# EAGLE schematic GPSDOXCO (EAGLE 7.7.0)
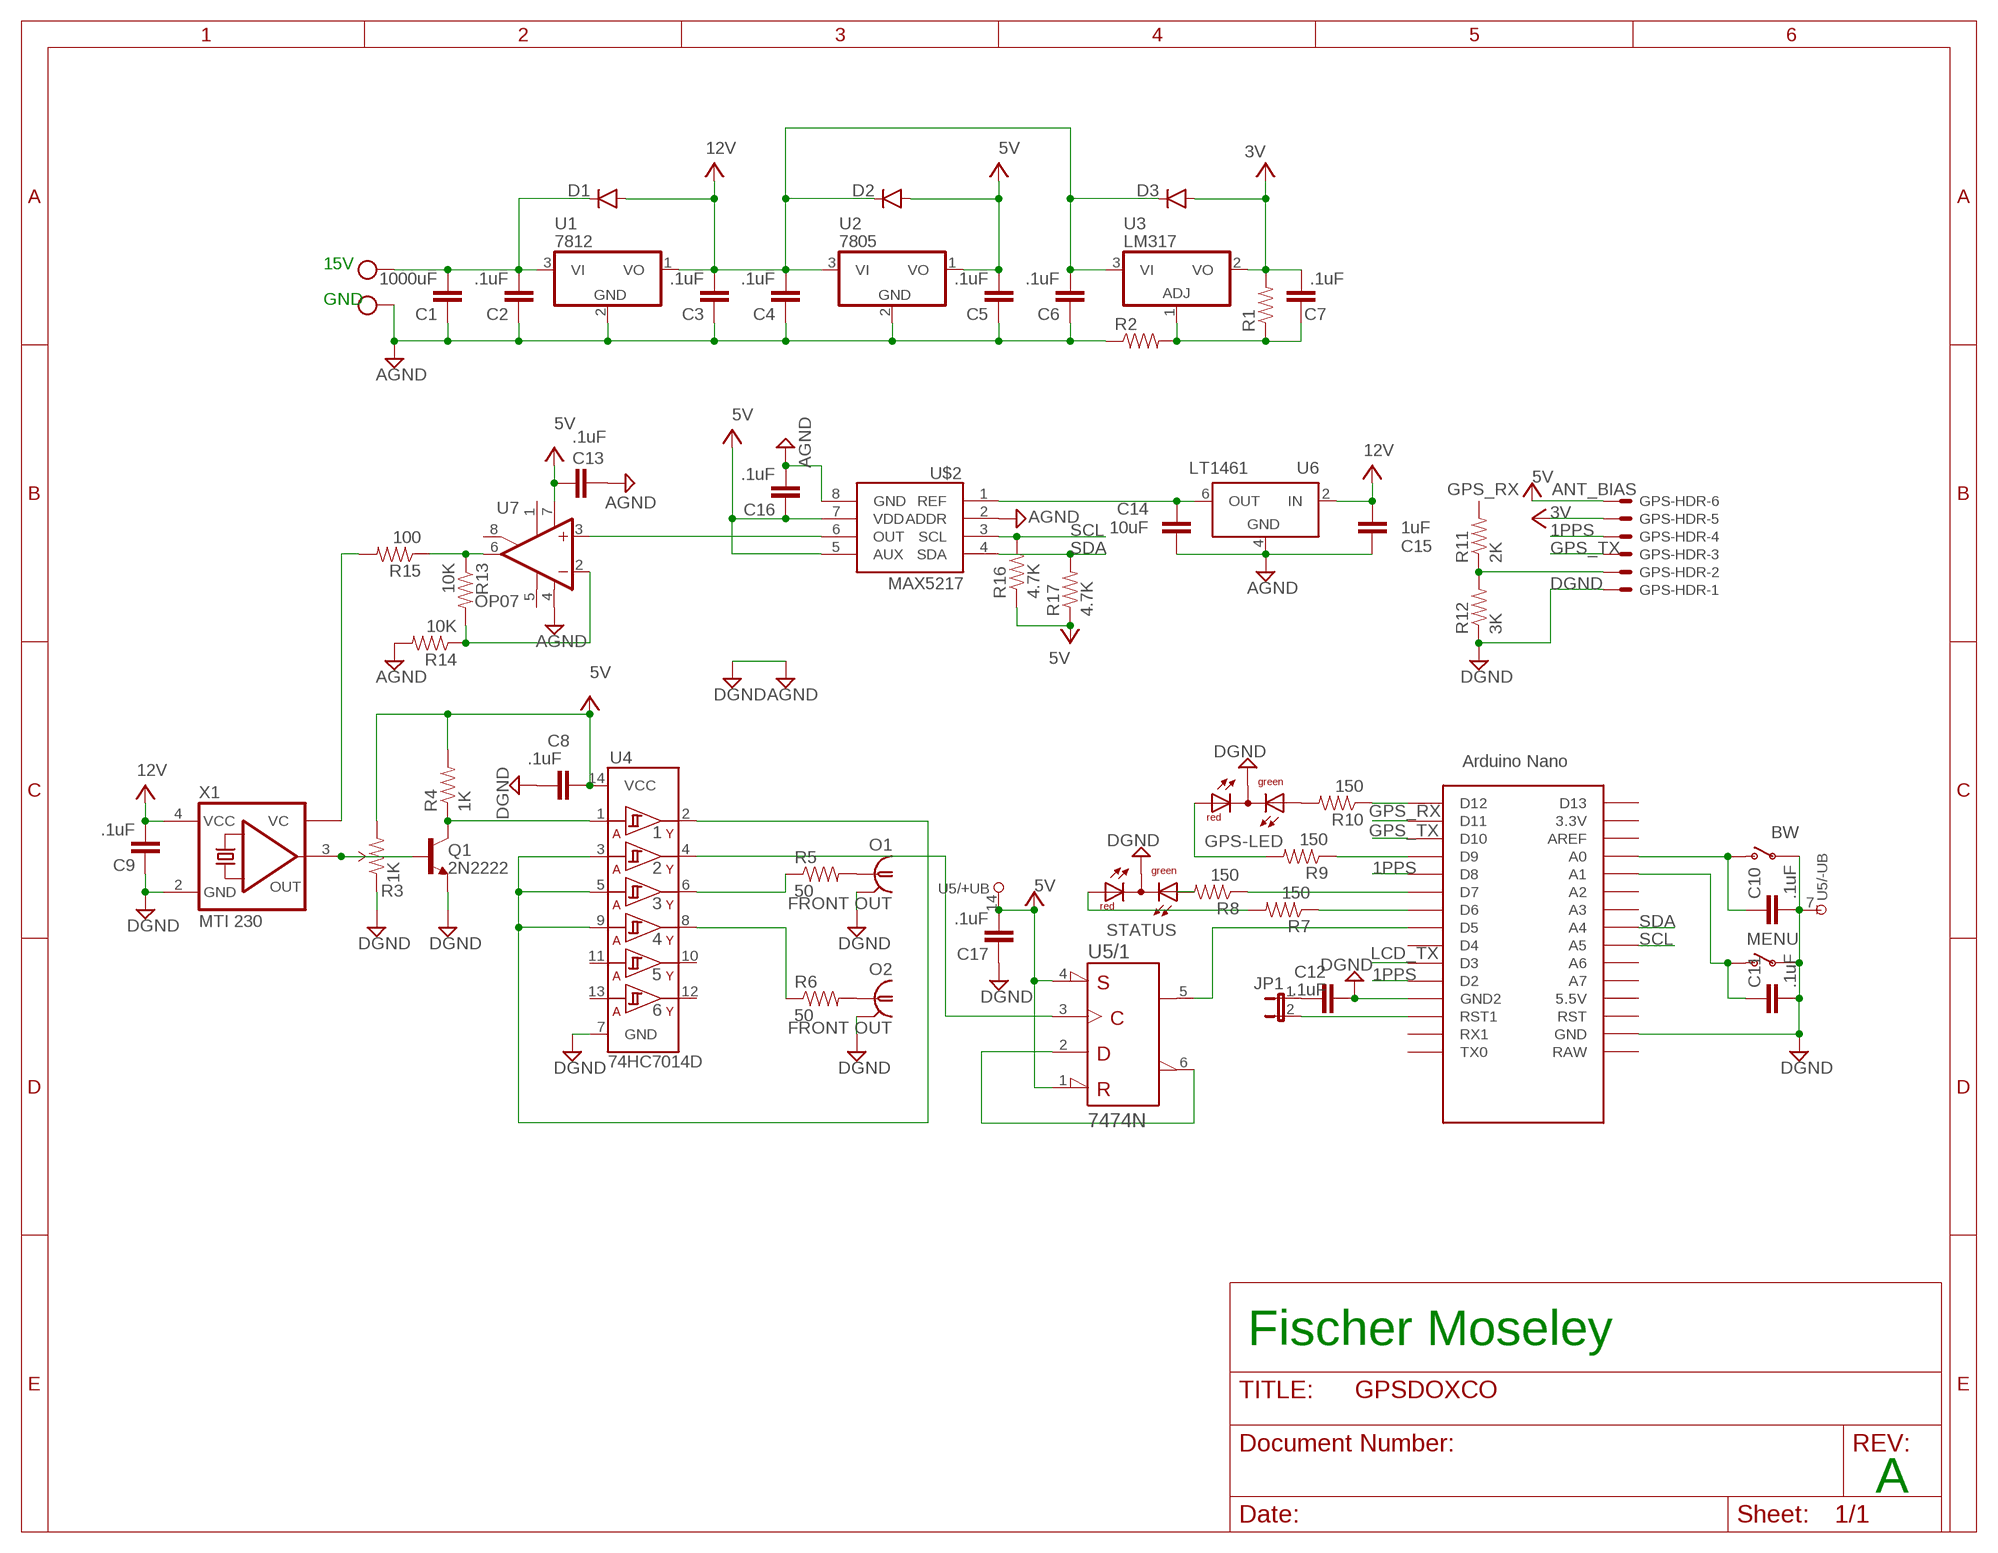
[diagram p0: schematic, sheet 1]

## Parts
+15V  +15  AK300/2  [AK300/2]
BW  SWITCH-SPST-2RA  [R_SW_TH]
C1  1000uF  C2.5/2  [C2.5-2]
C2  .1uF  C2.5/2  [C2.5-2]
C3  .1uF  C2.5/2  [C2.5-2]
C4  .1uF  C2.5/2  [C2.5-2]
C5  .1uF  C2.5/2  [C2.5-2]
C6  .1uF  C2.5/2  [C2.5-2]
C7  .1uF  C2.5/2  [C2.5-2]
C8  .1uF  C2.5/2  [C2.5-2]
C9  .1uF  C2.5/2  [C2.5-2]
C10  .1uF  C2.5/2  [C2.5-2]
C11  .1uF  C2.5/2  [C2.5-2]
C12  .1uF  C2.5/2  [C2.5-2]
C13  .1uF  C2.5/2  [C2.5-2]
C14  10uF  C2.5/2  [C2.5-2]
C15  1uF  C2.5/2  [C2.5-2]
C16  .1uF  C2.5/2  [C2.5-2]
C17  .1uF  C2.5/2  [C2.5-2]
D1  DIODEBAS16  [SOD-323]
D2  DIODEBAS16  [SOD-323]
D3  DIODEBAS16  [SOD-323]
GPS-HDR  22-23-2061  [22-23-2061]
GPS-LED  DUOLED-RG-C  [DUOLED-C-5MM]
JP1  JUMPER-2PTH_LOCK  [1X02_LOCK]
MENU  SWITCH-SPST-2RA  [R_SW_TH]
O1  FRONT OUT  R141426  [R141426]
O2  FRONT OUT  R141426  [R141426]
Q1  2N2222  [TO18]
R1  RESISTOR0402-RES  [0402-RES]
R2  RESISTOR0402-RES  [0402-RES]
R3  1K  TRIMPOT  [TRIMPOT-5MM-V2]
R4  1K  RESISTOR0402-RES  [0402-RES]
R5  50  RESISTOR0402-RES  [0402-RES]
R6  50  RESISTOR0402-RES  [0402-RES]
R7  150  RESISTOR0402-RES  [0402-RES]
R8  150  RESISTOR0402-RES  [0402-RES]
R9  150  RESISTOR0402-RES  [0402-RES]
R10  150  RESISTOR0402-RES  [0402-RES]
R11  2K  RESISTOR0402-RES  [0402-RES]
R12  3K  RESISTOR0402-RES  [0402-RES]
R13  10K  RESISTOR0402-RES  [0402-RES]
R14  10K  RESISTOR0402-RES  [0402-RES]
R15  100  RESISTOR0402-RES  [0402-RES]
R16  4.7K  RESISTOR0402-RES  [0402-RES]
R17  4.7K  RESISTOR0402-RES  [0402-RES]
STATUS  DUOLED-RG-C  [DUOLED-C-5MM]
U1  7812  78L12Z  [TO92]
U2  7805  78L05Z  [TO92]
U3  LM317  LM317LZ  [TO92]
U4  74HC7014D  [SOIC-14]
U5  7474N  [DIL14]
U6  LT1461  LT1021N  [DIL08]
U7  OP07  OP07AH  [TO99]
U$1  NANO  [NANO]
U$2  MAX5217  MAX5217A  [MSOP-8]
X1  MTI 230  TCXO-CFPT-125  [7.0X5.0-4-PAD]

## Nets
1PPS: GPS-HDR.4 U$1.D2 U$1.D8
3V: C7.2 D3.A R1.2 U3.2(VO)
5MHZ_MCU: U5.5(/1:Q) U$1.D5
5V: C5.2 D2.A U2.1(VO)
+3V3: GPS-HDR.5 ; supply symbol labelled 3V
+5V: C8.2 C13.1 C16.1 C17.2 R3.C(CW) R4.2 R16.1 R17.1 U4.14(VCC) U5.1(/1:!CLR) U5.4(/1:!PRE) U5.14(/+UB:+UB) U7.7(V+) U$2.5(AUX) U$2.7(VDD) ; supply symbol labelled 5V
AGND: +15V.2 C1.1 C2.1 C3.1 C4.1 C5.1 C6.1 C13.2 C14.1 C15.2 C16.2 R2.1 R14.2 U1.2(GND) U2.2(GND) U6.4(GND) U7.4(V-) U$2.2(ADDR) U$2.8(GND) ; supply symbol labelled DGND
ANT_BIAS: GPS-HDR.6 ; supply symbol labelled 5V
DGND: BW.P$4(P) C8.1 C9.1 C10.2 C11.2 C12.2 C17.1 GPS-HDR.1 GPS-LED.C MENU.P$4(P) O1.2 O1.3 O1.4 O1.5 O2.2 O2.3 O2.4 O2.5 Q1.1(E) R3.A(CCW) R12.1 STATUS.C U4.7(GND) U5.7(/-UB:-UB) U$1.GND U$1.GND1(GND2) X1.2(GND)
GPS_RX: GPS-HDR.2 R11.1 R12.2 U$1.D11
GPS_TX: GPS-HDR.3 U$1.D10
LCD_TX: U$1.D3
N$1: R5.1 U4.6(3Y)
N$2: C7.1 R1.1 R2.2 U3.1(ADJ)
N$3: +15V.1 C1.2 C2.2 D1.C U1.3(VI)
N$4: Q1.3(C) R4.1 U4.1(1A)
N$5: U4.2(1Y) U4.3(2A) U4.5(3A) U4.9(4A)
N$6: R6.1 U4.8(4Y)
N$7: U4.4(2Y) U5.3(/1:CLK)
N$8: O1.1 R5.2
N$9: O2.1 R6.2
N$10: U5.2(/1:D) U5.6(/1:!Q)
N$11: R15.2 X1.1(VC)
N$12: R10.1 U$1.D12
N$13: R9.1 U$1.D9
N$14: R7.1 U$1.D6
N$15: R8.1 U$1.D7
N$16: GPS-LED.AX(AG) R10.2
N$17: GPS-LED.AR R9.2
N$18: R8.2 STATUS.AX(AG)
N$19: R7.2 STATUS.AR
N$20: C12.1 JP1.1
N$21: C11.1 MENU.P$3(O) U$1.A1
N$22: BW.P$3(O) C10.1 U$1.A0
N$23: U7.3(+IN) U$2.6(OUT)
N$24: JP1.2 U$1.RST1
N$25: R13.1 R15.1 U7.6(OUT)
N$26: R13.2 R14.1 U7.2(-IN)
N$27: C14.2 U6.6(OUT) U$2.1(REF)
R3: Q1.2(B) R3.B(WIPER) X1.3(OUT)
SCL: R16.2 U$1.A5 U$2.3(SCL)
SDA: R17.2 U$1.A4 U$2.4(SDA)
V+: C3.2 C4.2 C6.2 C9.2 C15.1 D1.A D2.C D3.C U1.1(VO) U2.3(VI) U3.3(VI) U6.2(IN) X1.4(VCC) ; supply symbol labelled 12V
Unconnected: R11.2 U4.10(5Y) U4.11(5A) U4.12(6Y) U4.13(6A) U5.8(/2:!Q) U5.9(/2:Q) U5.10(/2:!PRE) U5.11(/2:CLK) U5.12(/2:D) U5.13(/2:!CLR) U7.1(ON1) U7.5(OPT) U7.8(ON2) U$1.3.3V U$1.5V(5.5V) U$1.A2 U$1.A3 U$1.A6 U$1.A7 U$1.AREF U$1.D4 U$1.D13 U$1.ICSP1 U$1.ICSP2 U$1.ICSP3 U$1.ICSP4 U$1.ICSP5 U$1.ICSP6 U$1.RAW U$1.RST U$1.RX1 U$1.TX0

## Notes on the sheet
- 15V
- GND
- Fischer Moseley
- A

## Library data of the parts
+15V = con-ptr500:AK300/2: CONNECTOR; OC_FARNELL: unknown; OC_NEWARK: unknown
BW MENU = SparkFun-Electromechanical:SWITCH-SPST-2
C1-C17 = capacitor-wima:C: CAPACITOR naming: grid - package width
D1-D3 = SparkFun-DiscreteSemi:DIODE: Diode These are standard reverse protection diodes and small signal diodes. SMA package can handle up to about 1A. SOD-323 can handle about 200mA. What the SOD-323 package when ordering, there are some mfgs out there that are 5-pin packages.; PROD_ID: DIO-09646; VALUE: 250mA/100V
GPS-HDR = con-molex:22-23-2061: .100" (2.54mm) Center Header - 6 Pin; MF: MOLEX; MPN: 22-23-2061; OC_FARNELL: 1462922; OC_NEWARK: 27C1933
GPS-LED STATUS = led:DUOLED-RG-C: DUO LED 2 colors (red/green), 5 mm, round, common Cathode www.ligitek.com or other producers.
JP1 = SparkFun-Retired:JUMPER-2: Jumper Basic 0.1" spaced jumper. Use with breakaway headers.
O1 O2 = con-coax:R141426: BNC COAX CONNECTOR Radiall 50/75 Ohm Spoerle; MF: FARNELL; MPN: R141426161; OC_FARNELL: 4195115; OC_NEWARK: 14J7919
Q1 = transistor-npn:2N2222*: NPN Transistor
R1 R2 R4-R17 = SparkFun-Passives:RESISTOR: Resistor Basic schematic elements and footprints for 0603, 1206, and PTH resistors.
R3 = SparkFun-Electromechanical:TRIMPOT: Various small potentiometers for "set-and-forget" applications
U1 U2 = linear:78*: Positive VOLTAGE REGULATOR Source: http://cache.national.com/ds/LM/LM78L05.pdf http://www.fairchildsemi.com/ds/LM/LM7805.pdf
U3 = linear:*317: Positive VOLTAGE REGULATOR
U4 = SparkFun-DigitalIC:74HC7014D: The 74HC7014 is a hex buffer with precision Schmitt-trigger inputs. The precisely defined trigger levels are lying in a window between (0.55 x VCC) and (0.65 x VCC). It makes the circuit suitable to operate in a highly noisy environment. Input shorts are allowed to -1.5 V and +16 V without disturbing other channels. Inputs include clamp diodes that enable the use of current limiting resistors to interface inputs to voltages in excess of VCC. Schmitt trigger inputs transform slowly changing input signals into sharply defined jitter-free output signals.; PROD_ID: IC-12527
U5 = 74ttl-din:74*74: Dual D type positive edge triggered FLIP FLOP, preset and clear
U6 = linear-technology:LT1021: Precision Reference Source: http://www.linear.com/pc/downloadDocument.do?navId=H0,C1,C1010,C1603,P1229,D2805; MPN: LT1021BCN8-5#PBF; OC_FARNELL: 1273427; OC_NEWARK: 24M3927
U7 = linear:OP07*: OP AMP
U$1 = arduino:NANO: Arduino Nano
U$2 = moseley:MAX5217
X1 = IQD-Frequency-Products:TCXO: CRYSTAL RESONATOR